# Altium schematic sheet Sheet1.SchDoc
size A; SheetNumber: 8; SheetTotal: 8
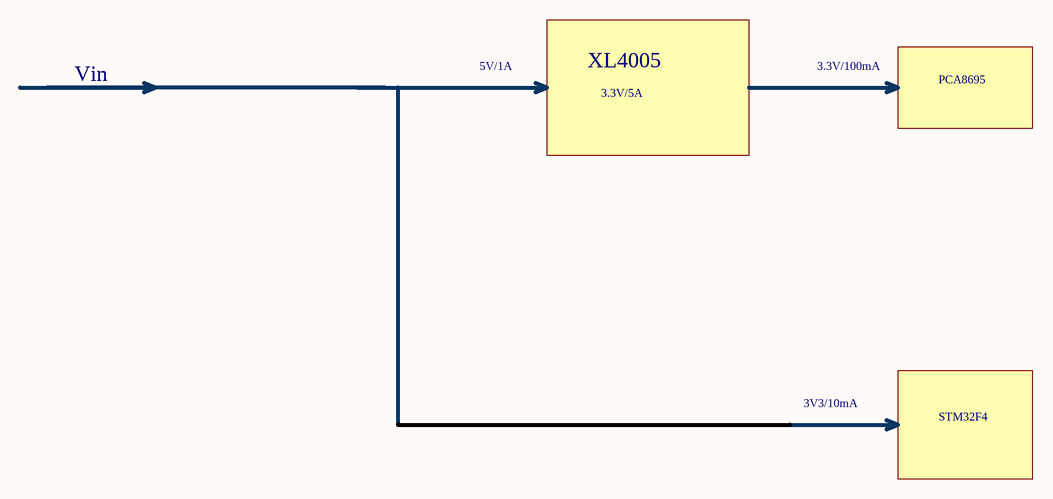
[diagram p0: Sheet1.SchDoc]

## Notes on the sheet
- Vin
- 5V/1A
- XL4005
- 3.3V/5A
- 3.3V/100mA
- PCA8695
- 3V3/10mA
- STM32F4